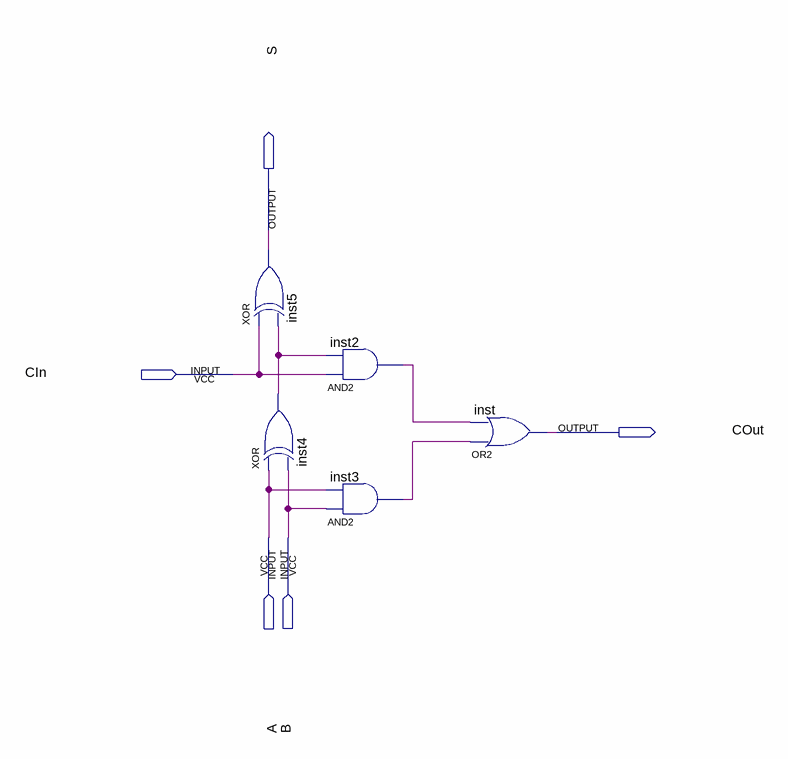
[diagram p0: schematic sheet]
// Quartus schematic Somador.bdf as structural Verilog: 5 symbols, 5 pins
module Somador (
  input  CIn,
  input  A,
  input  B,
  output S,
  output COut
);

  wire inst2_out, inst3_out, inst4_out;

  xor inst5 (S, CIn, inst4_out);
  xor inst4 (inst4_out, A, B);
  and inst2 (inst2_out, CIn, inst4_out);
  and inst3 (inst3_out, B, A);
  or inst (COut, inst3_out, inst2_out);
endmodule
